# EasyEDA Pro project ALU.eprj

# Schematic Schematic2
Board Name: Board2; Create Date: 2025-08-15; Page Name: P1; Project Name: ALU; Schematic Name: Schematic2; Update Date: 2025-08-15; Company: EasyEDA.com; Page Size: A4; Version: V1.0
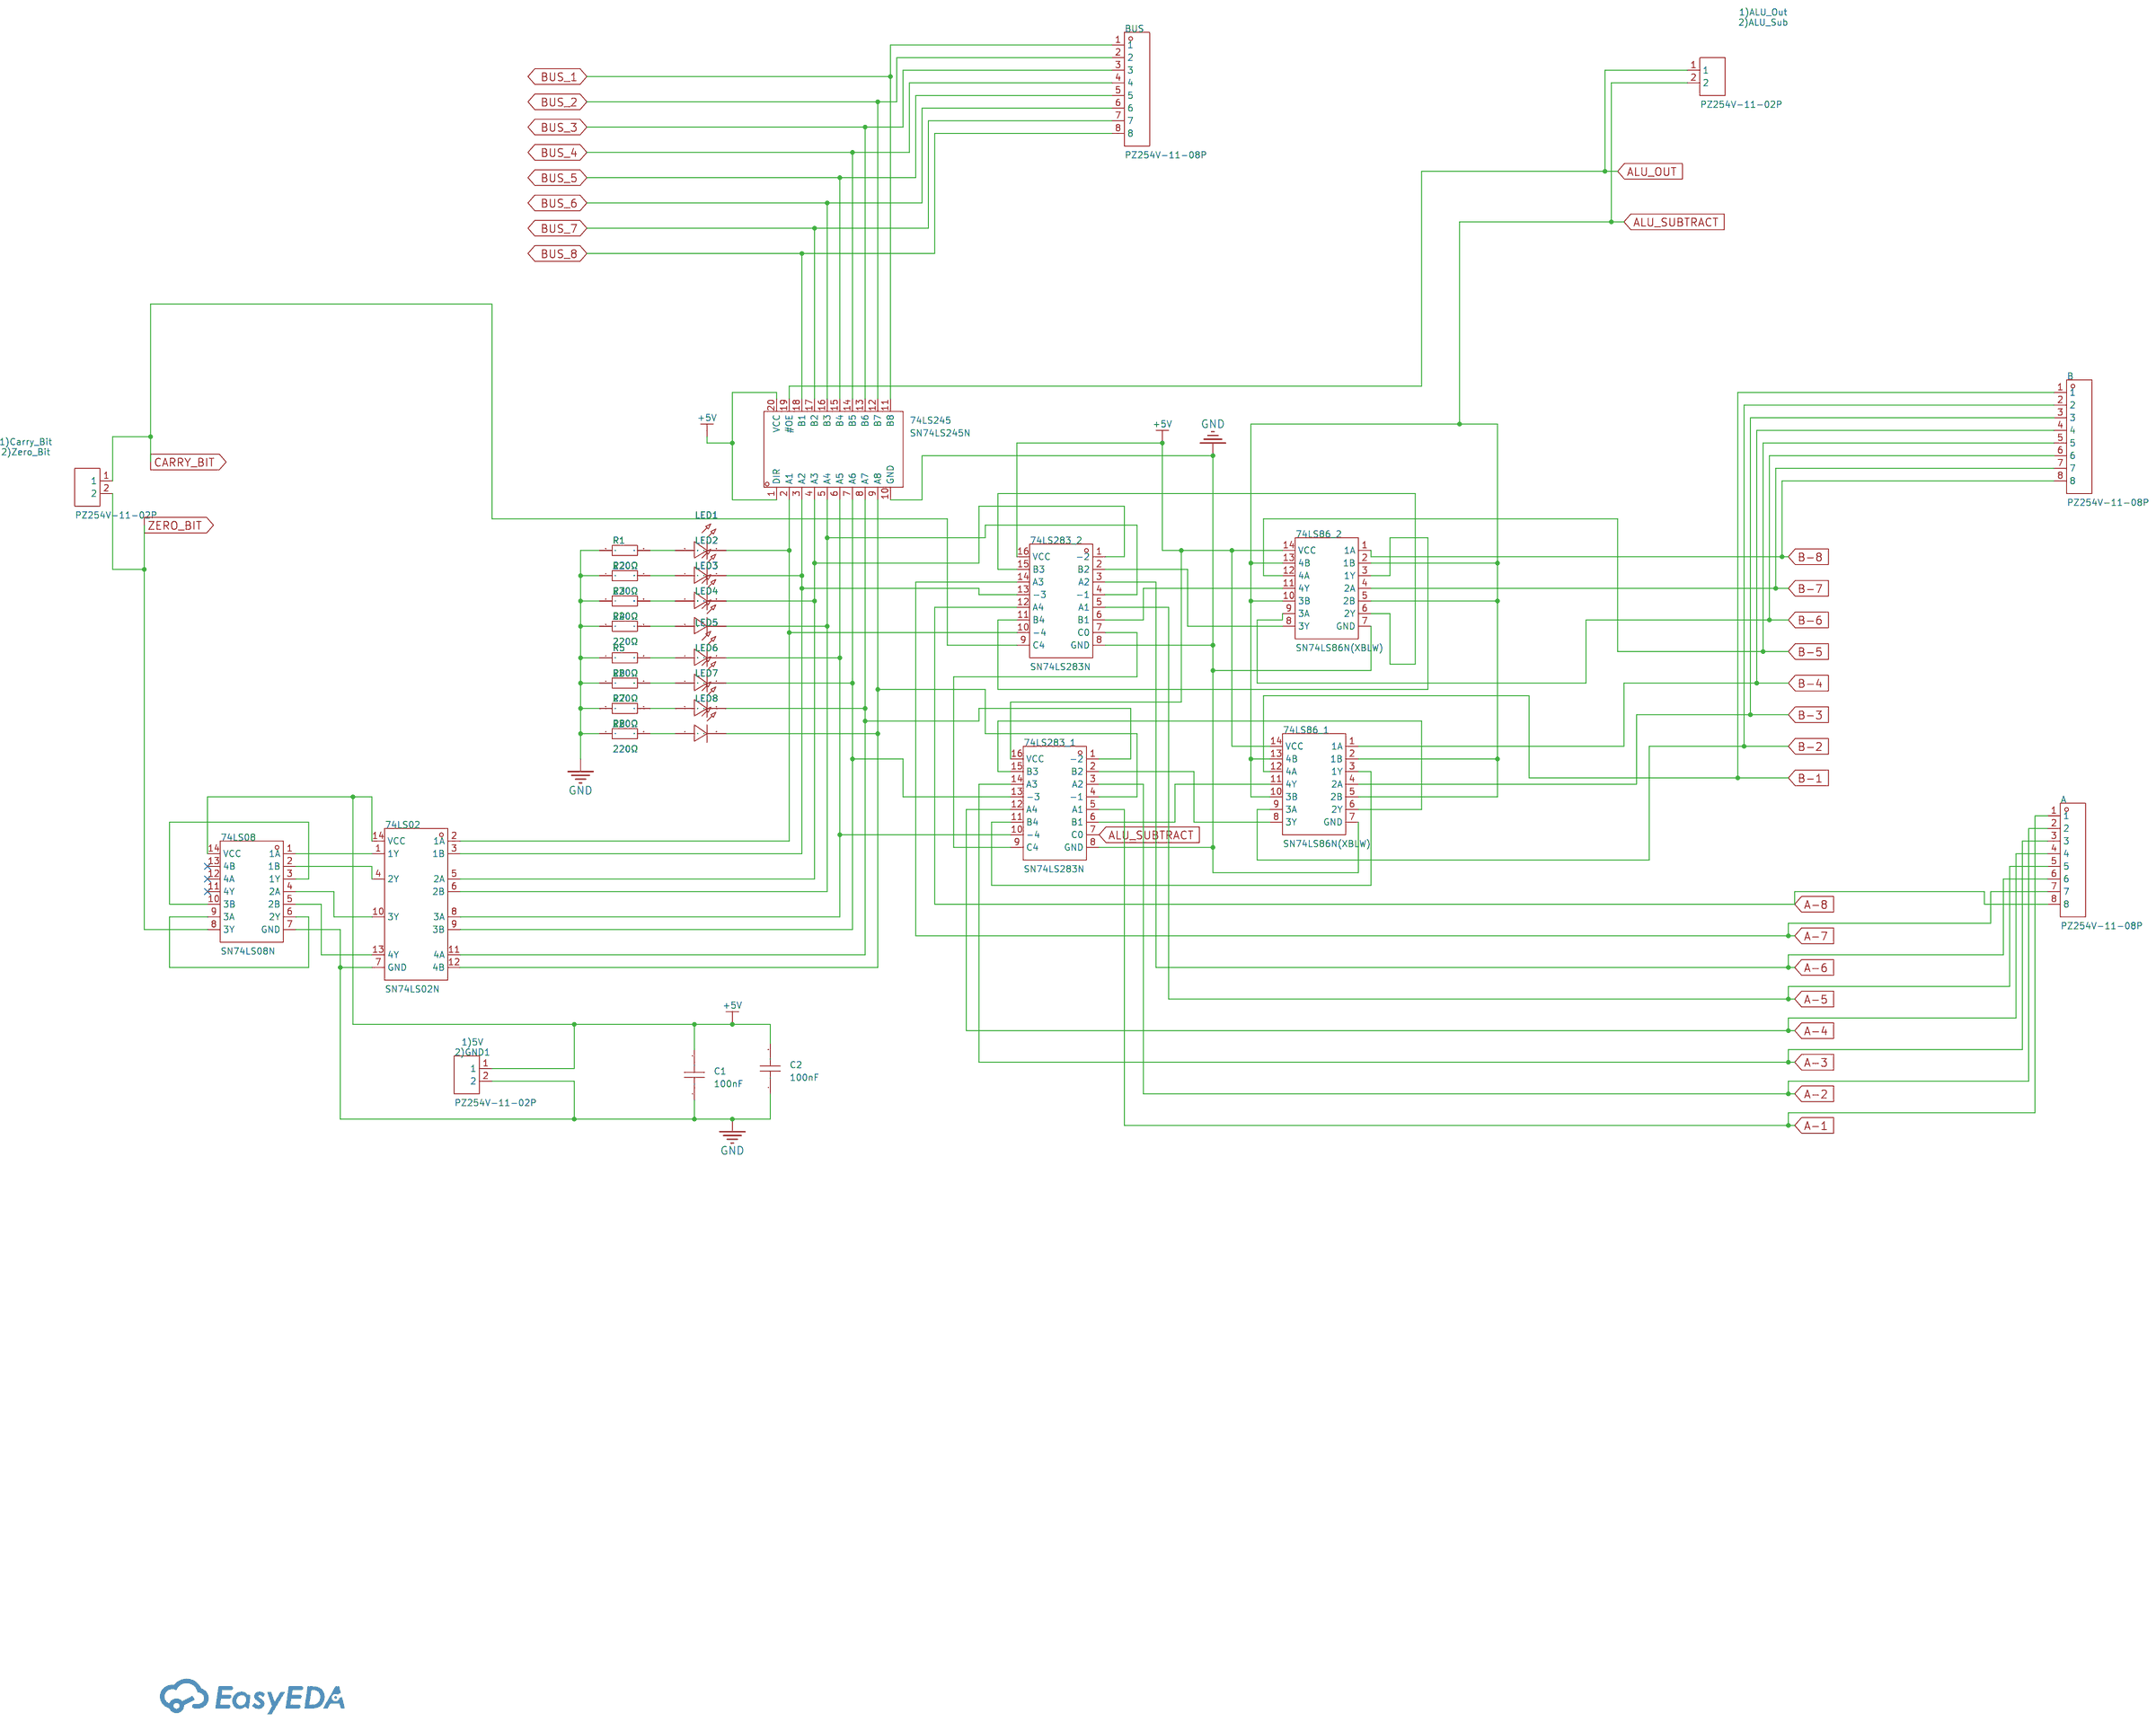
[diagram p0: schematic sheet]

## Parts
1)5V
2)GND1  PZ254V-11-02P  [HDR-TH_2P-P2.54-V-M]
1)ALU_Out
2)ALU_Sub  PZ254V-11-02P  [HDR-TH_2P-P2.54-V-M]
1)Carry_Bit
2)Zero_Bit  PZ254V-11-02P  [HDR-TH_2P-P2.54-V-M]
74LS02  SN74LS02N  [PDIP-14_L19.3-W6.4-P2.54-LS7.6-BL]
74LS08  SN74LS08N  [PDIP-14_L19.3-W6.4-P2.54-LS7.9-BL-1]
74LS86_1  SN74LS86N(XBLW)  [DIP-14_L19.0-W6.4-P2.54-LS7.6-BL]
74LS86_2  SN74LS86N(XBLW)  [DIP-14_L19.0-W6.4-P2.54-LS7.6-BL]
74LS245  SN74LS245N  [DIP-20_L25.5-W10.0-P2.54-LS7.6-BL]
74LS283_1  SN74LS283N  [PDIP-16_L19.3-W6.4-P2.54-LS7.94-BL]
74LS283_2  SN74LS283N  [PDIP-16_L19.3-W6.4-P2.54-LS7.94-BL]
A  PZ254V-11-08P  [HDR-TH_8P-P2.54-V-M]
B  PZ254V-11-08P  [HDR-TH_8P-P2.54-V-M]
BUS  PZ254V-11-08P  [HDR-TH_8P-P2.54-V-M]
C1  100nF  [CAP-TH_L8.5-W5.0-P5.00-D1.2]
C2  100nF  [CAP-TH_L8.5-W5.0-P5.00-D1.2]
LED1  -  [LED-TH_BD5.8-P2.54-FD]
LED2  -  [LED-TH_BD5.8-P2.54-FD]
LED3  -  [LED-TH_BD5.8-P2.54-FD]
LED4  -  [LED-TH_BD5.8-P2.54-FD]
LED5  -  [LED-TH_BD5.8-P2.54-FD]
LED6  -  [LED-TH_BD5.8-P2.54-FD]
LED7  -  [LED-TH_BD5.8-P2.54-FD]
LED8  -  [LED-TH_BD5.8-P2.54-FD]
R1  220Ω  [R_AXIAL-0.4]
R2  220Ω  [R_AXIAL-0.4]
R3  220Ω  [R_AXIAL-0.4]
R4  220Ω  [R_AXIAL-0.4]
R5  220Ω  [R_AXIAL-0.4]
R6  220Ω  [R_AXIAL-0.4]
R7  220Ω  [R_AXIAL-0.4]
R8  220Ω  [R_AXIAL-0.4]

## Library data of the parts
1)5V
2)GND1 1)ALU_Out
2)ALU_Sub 1)Carry_Bit
2)Zero_Bit = PZ254V-11-02P: Pin Structure:1x2P Pitch:2.54mm Row Spacing:- Circluar Pins/Square Pins:Policy Mounting Type:Straight Number of Rows:Single Row Number of Pins:2P Current Rating:- Voltage Rating (Max):- Length of Mating Pin:6mm Insulation Height:2.5mm Length of End Connec; LCSC Part Name: 1x2P 间距:2.54mm 方针 直插; Supplier Part: C492401; Manufacturer: XFCN(兴飞); Supplier Footprint: 插件,P=2.54mm; JLCPCB Part Class: Extended Part; Datasheet: https://atta.szlcsc.com/upload/public/pdf/source/20200309/C492401_A812433581A9B211A7FFA413ADDFF0E5.pdf; Supplier: LCSC; Pin Structure: 1x2P; Pitch: 2.54mm; Circluar Pins/Square Pins: Policy; Mounting Type: Straight; Number of Rows: Single Row; Number of Pins: 2P; Length of Mating Pin: 6mm; Insulation Height: 2.5mm; Length of End Connection Pin: 3mm; Contact Material: Brass; Operating Temperature: -40℃~+105℃; Color: Black
74LS02 = SN74LS02N: Logic Gate Type:NORGate Number of Channels:4 Supply Voltage:4.75V~5.25V Supply Voltage:4.75V~5.25V Sink Current:16mA Source Current:400uA High Level Range (VIH):2V High Level Range (VIH):2V Low Level Range (VIL):800mV Low Level Range (VIL):800mV Series:74; Supplier Part: C273654; Manufacturer: TI(德州仪器); Supplier Footprint: PDIP-14; JLCPCB Part Class: Extended Part; Datasheet: https://www.ti.com/cn/lit/gpn/sn74ls02; Supplier: LCSC; Logic Gate Type: NORGate; Number of Channels: 4; Supply Voltage: 4.75V~5.25V; Sink Current: 16mA; Source Current: 400uA; High Level Range (VIH): 2V; Low Level Range (VIL): 800mV; Series: 74LSSeries; Propagation Delay Time: 15ns@5V,15pF; Operating Temperature: 0℃~+70℃
74LS08 = SN74LS08N: Logic Type:AND Gate Number of Channels:4 Voltage - Supply:4.75V~5.25V Voltage - Supply:4.75V~5.25V Current - Output Low(IOL):8mA Current - Output High(IOH):400uA Input Logic Level - High:2V Input Logic Level - High:2V Input Logic Level - Low:800mV Input L; Supplier Part: C2869595; Manufacturer: TI(德州仪器); Supplier Footprint: PDIP-14; JLCPCB Part Class: Extended Part; Datasheet: https://www.ti.com/cn/lit/gpn/sn54s08; Supplier: LCSC; Logic Type: AND Gate; Number of Channels: 4; Voltage - Supply: 4.75V~5.25V; Current - Output Low(IOL): 8mA; Current - Output High(IOH): 400uA; Input Logic Level - High: 2V; Input Logic Level - Low: 800mV; Series: 74LSSeries; Operating Temperature: 0℃~+70℃
74LS86_1 74LS86_2 = SN74LS86N(XBLW): Logic Type:XOR Gate Number of Channels:4 Voltage - Supply:2V~6V Voltage - Supply:2V~6V Quiescent Current:2uA Current - Output Low(IOL):5.2mA Current - Output High(IOH):5.2mA Input Logic Level - High:1.2V~3.2V Input Logic Level - High:1.2V~3.2V Input Logic; Supplier Part: C42415784; Manufacturer: XBLW(芯伯乐); Supplier Footprint: DIP-14; Datasheet: https://atta.szlcsc.com/upload/public/pdf/source/20241217/4BD867E8FF5FB27D45A6321784BC3EB1.pdf; Supplier: LCSC; Logic Type: XOR Gate; Number of Channels: 4; Voltage - Supply: 2V~6V; Quiescent Current: 2uA; Current - Output Low(IOL): 5.2mA; Current - Output High(IOH): 5.2mA; Input Logic Level - High: 1.2V~3.2V; Input Logic Level - Low: 800mV~2.8V; Output Logic Level - High: 2V~5.81V
74LS245 = SN74LS245N: output type:Tri-State Voltage - Supply:4.75V~5.25V Voltage - Supply:4.75V~5.25V Number of Elements:1 Number of Bits per Element:8 Current - Output Low(IOL):24mA Current - Output High(IOH):15mA Logic Family:74LS Operating Temperature:0℃~+70℃ Operating Temp; Supplier Part: C352966; Manufacturer: TI(德州仪器); Supplier Footprint: DIP-20; JLCPCB Part Class: Extended Part; Datasheet: https://www.ti.com/cn/lit/gpn/sn74ls245; Supplier: LCSC; output type: Tri-State; Voltage - Supply: 4.75V~5.25V; Number of Elements: 1; Number of Bits per Element: 8; Current - Output Low(IOL): 24mA; Current - Output High(IOH): 15mA; Logic Family: 74LS; Operating Temperature: 0℃~+70℃
74LS283_1 74LS283_2 = SN74LS283N: LCSC Part Name: 二进制全加器; Supplier Part: C1523494; Manufacturer: TI(德州仪器); Supplier Footprint: PDIP-16; JLCPCB Part Class: Extended Part; Datasheet: https://www.ti.com/cn/lit/gpn/sn74ls283; Supplier: LCSC
A B BUS = PZ254V-11-08P: Pin Structure:1x8P Pitch:2.54mm Row Spacing:- Circluar Pins/Square Pins:Square Pins Mounting Type:Straight Number of Rows:Plugin Number of Pins:8P Current Rating (Max):- Voltage Rating (Max):- Length of Mating Pin:6mm Insulation Height:2.5mm Length of End; LCSC Part Name: 间距:2.54mm 1x8P 直插 方针; Supplier Part: C492407; Manufacturer: XFCN(兴飞); Supplier Footprint: 插件,P=2.54mm; JLCPCB Part Class: Extended Part; Datasheet: https://atta.szlcsc.com/upload/public/pdf/source/20200309/C492407_83A6FB26A2233368EDB9516968EC6149.pdf; Supplier: LCSC; Pin Structure: 1x8P; Pitch: 2.54mm; Circluar Pins/Square Pins: Square Pins; Mounting Type: Straight; Number of Rows: Plugin; Number of Pins: 8P; Length of Mating Pin: 6mm; Insulation Height: 2.5mm; Length of End Connection Pin: 3mm; Operating Temperature Range: -40℃~+105℃; Color: Black
C1 C2 = CT4-0805B104K500F3: Capacitance:100nF Tolerance:±10% Tolerance:±10% Voltage Rated: Temperature Coefficient:; LCSC Part Name: 100nF ±10% 50V C3型（直脚）; Supplier Part: C84772; Manufacturer: FH(风华); Supplier Footprint: 插件,P=5.08mm; JLCPCB Part Class: Extended Part; Datasheet: https://atta.szlcsc.com/upload/public/pdf/source/20190402/C385200_059806A6312B28FF1421A2413EB641E1.pdf; Supplier: LCSC; Tolerance: ±10%
LED1-LED8 = LED_TH-R_5mm: Supplier Footprint: Through
R1-R8 = Res_AXIAL-1/4W: Supplier Footprint: Through

## Nets
+5V: 1)5V
2)GND1.1 74LS02.14(VCC) 74LS08.14(VCC) 74LS86_1.14(VCC) 74LS86_2.14(VCC) 74LS245.1(DIR) 74LS245.20(VCC) 74LS283_1.16(VCC) 74LS283_2.16(VCC) C1.2 C2.2
GND: 1)5V
2)GND1.2 74LS02.7(GND) 74LS08.7(GND) 74LS86_1.7(GND) 74LS86_2.7(GND) 74LS245.10(GND) 74LS283_1.8(GND) 74LS283_2.8(GND) C1.1 C2.1 R1.1 R2.1 R3.1 R4.1 R5.1 R6.1 R7.1 R8.1
A-1: 74LS283_1.5(A1) A.1
A-2: 74LS283_1.3(A2) A.2
A-3: 74LS283_1.14(A3) A.3
A-4: 74LS283_1.12(A4) A.4
A-5: 74LS283_2.5(A1) A.5
A-6: 74LS283_2.3(A2) A.6
A-7: 74LS283_2.14(A3) A.7
A-8: 74LS283_2.12(A4) A.8
ALU_OUT: 1)ALU_Out
2)ALU_Sub.1 74LS245.19(#OE)
ALU_SUBTRACT: 1)ALU_Out
2)ALU_Sub.2 74LS86_1.2(1B) 74LS86_1.5(2B) 74LS86_1.10(3B) 74LS86_1.13(4B) 74LS86_2.2(1B) 74LS86_2.5(2B) 74LS86_2.10(3B) 74LS86_2.13(4B) 74LS283_1.7(C0)
B-1: 74LS86_1.12(4A) B.1
B-2: 74LS86_1.9(3A) B.2
B-3: 74LS86_1.4(2A) B.3
B-4: 74LS86_1.1(1A) B.4
B-5: 74LS86_2.12(4A) B.5
B-6: 74LS86_2.9(3A) B.6
B-7: 74LS86_2.4(2A) B.7
B-8: 74LS86_2.1(1A) B.8
BUS_1: 74LS245.11(B8) BUS.1
BUS_2: 74LS245.12(B7) BUS.2
BUS_3: 74LS245.13(B6) BUS.3
BUS_4: 74LS245.14(B5) BUS.4
BUS_5: 74LS245.15(B4) BUS.5
BUS_6: 74LS245.16(B3) BUS.6
BUS_7: 74LS245.17(B2) BUS.7
BUS_8: 74LS245.18(B1) BUS.8
CARRY_BIT: 1)Carry_Bit
2)Zero_Bit.1 74LS283_2.9(C4)
ZERO_BIT: 1)Carry_Bit
2)Zero_Bit.2 74LS08.8(3Y)
$1N3474: LED1.1(C) R1.2
$1N3475: 74LS02.2(1A) 74LS245.2(A1) 74LS283_2.10(-4) LED1.2(A)
$1N3476: LED2.1(C) R2.2
$1N3477: LED3.1(C) R3.2
$1N3478: 74LS02.5(2A) 74LS245.4(A3) 74LS283_2.1(-2) LED3.2(A)
$1N3479: LED4.1(C) R4.2
$1N3480: LED5.1(C) R5.2
$1N3481: LED6.1(C) R6.2
$1N3482: LED7.1(C) R7.2
$1N3483: 74LS02.11(4A) 74LS245.8(A7) 74LS283_1.1(-2) LED7.2(A)
$1N3484: LED8.1(C) R8.2
$1N3486: 74LS02.1(1Y) 74LS08.1(1A)
$1N3487: 74LS08.3(1Y) 74LS08.10(3B)
$1N3488: 74LS02.10(3Y) 74LS08.4(2A)
$1N3489: 74LS02.4(2Y) 74LS08.2(1B)
$1N3491: 74LS02.8(3A) 74LS245.6(A5) 74LS283_1.10(-4) LED5.2(A)
$1N3492: 74LS02.6(2B) 74LS245.5(A4) 74LS283_2.4(-1) LED4.2(A)
$1N3493: 74LS02.3(1B) 74LS245.3(A2) 74LS283_2.13(-3) LED2.2(A)
$1N3494: 74LS283_1.9(C4) 74LS283_2.7(C0)
$1N3495: 74LS02.12(4B) 74LS245.9(A8) 74LS283_1.4(-1) LED8.2(A)
$1N3496: 74LS02.9(3B) 74LS245.7(A6) 74LS283_1.13(-3) LED6.2(A)
$1N3497: 74LS86_2.3(1Y) 74LS283_2.11(B4)
$1N3498: 74LS86_2.8(3Y) 74LS283_2.2(B2)
$1N3499: 74LS86_2.11(4Y) 74LS283_2.6(B1)
$1N3502: 74LS86_1.3(1Y) 74LS283_1.11(B4)
$1N3503: 74LS86_1.6(2Y) 74LS283_1.15(B3)
$1N3504: 74LS86_1.11(4Y) 74LS283_1.6(B1)
$1N3511: 74LS86_1.8(3Y) 74LS283_1.2(B2)
$1N3518: 74LS86_2.6(2Y) 74LS283_2.15(B3)
$1N3523: 74LS08.6(2Y) 74LS08.9(3A)
$1N3524: 74LS02.13(4Y) 74LS08.5(2B)

Not connected (* = marked no-connect by the designer): 74LS08 11(4Y)* 12(4A)* 13(4B)*

# Board PCB2
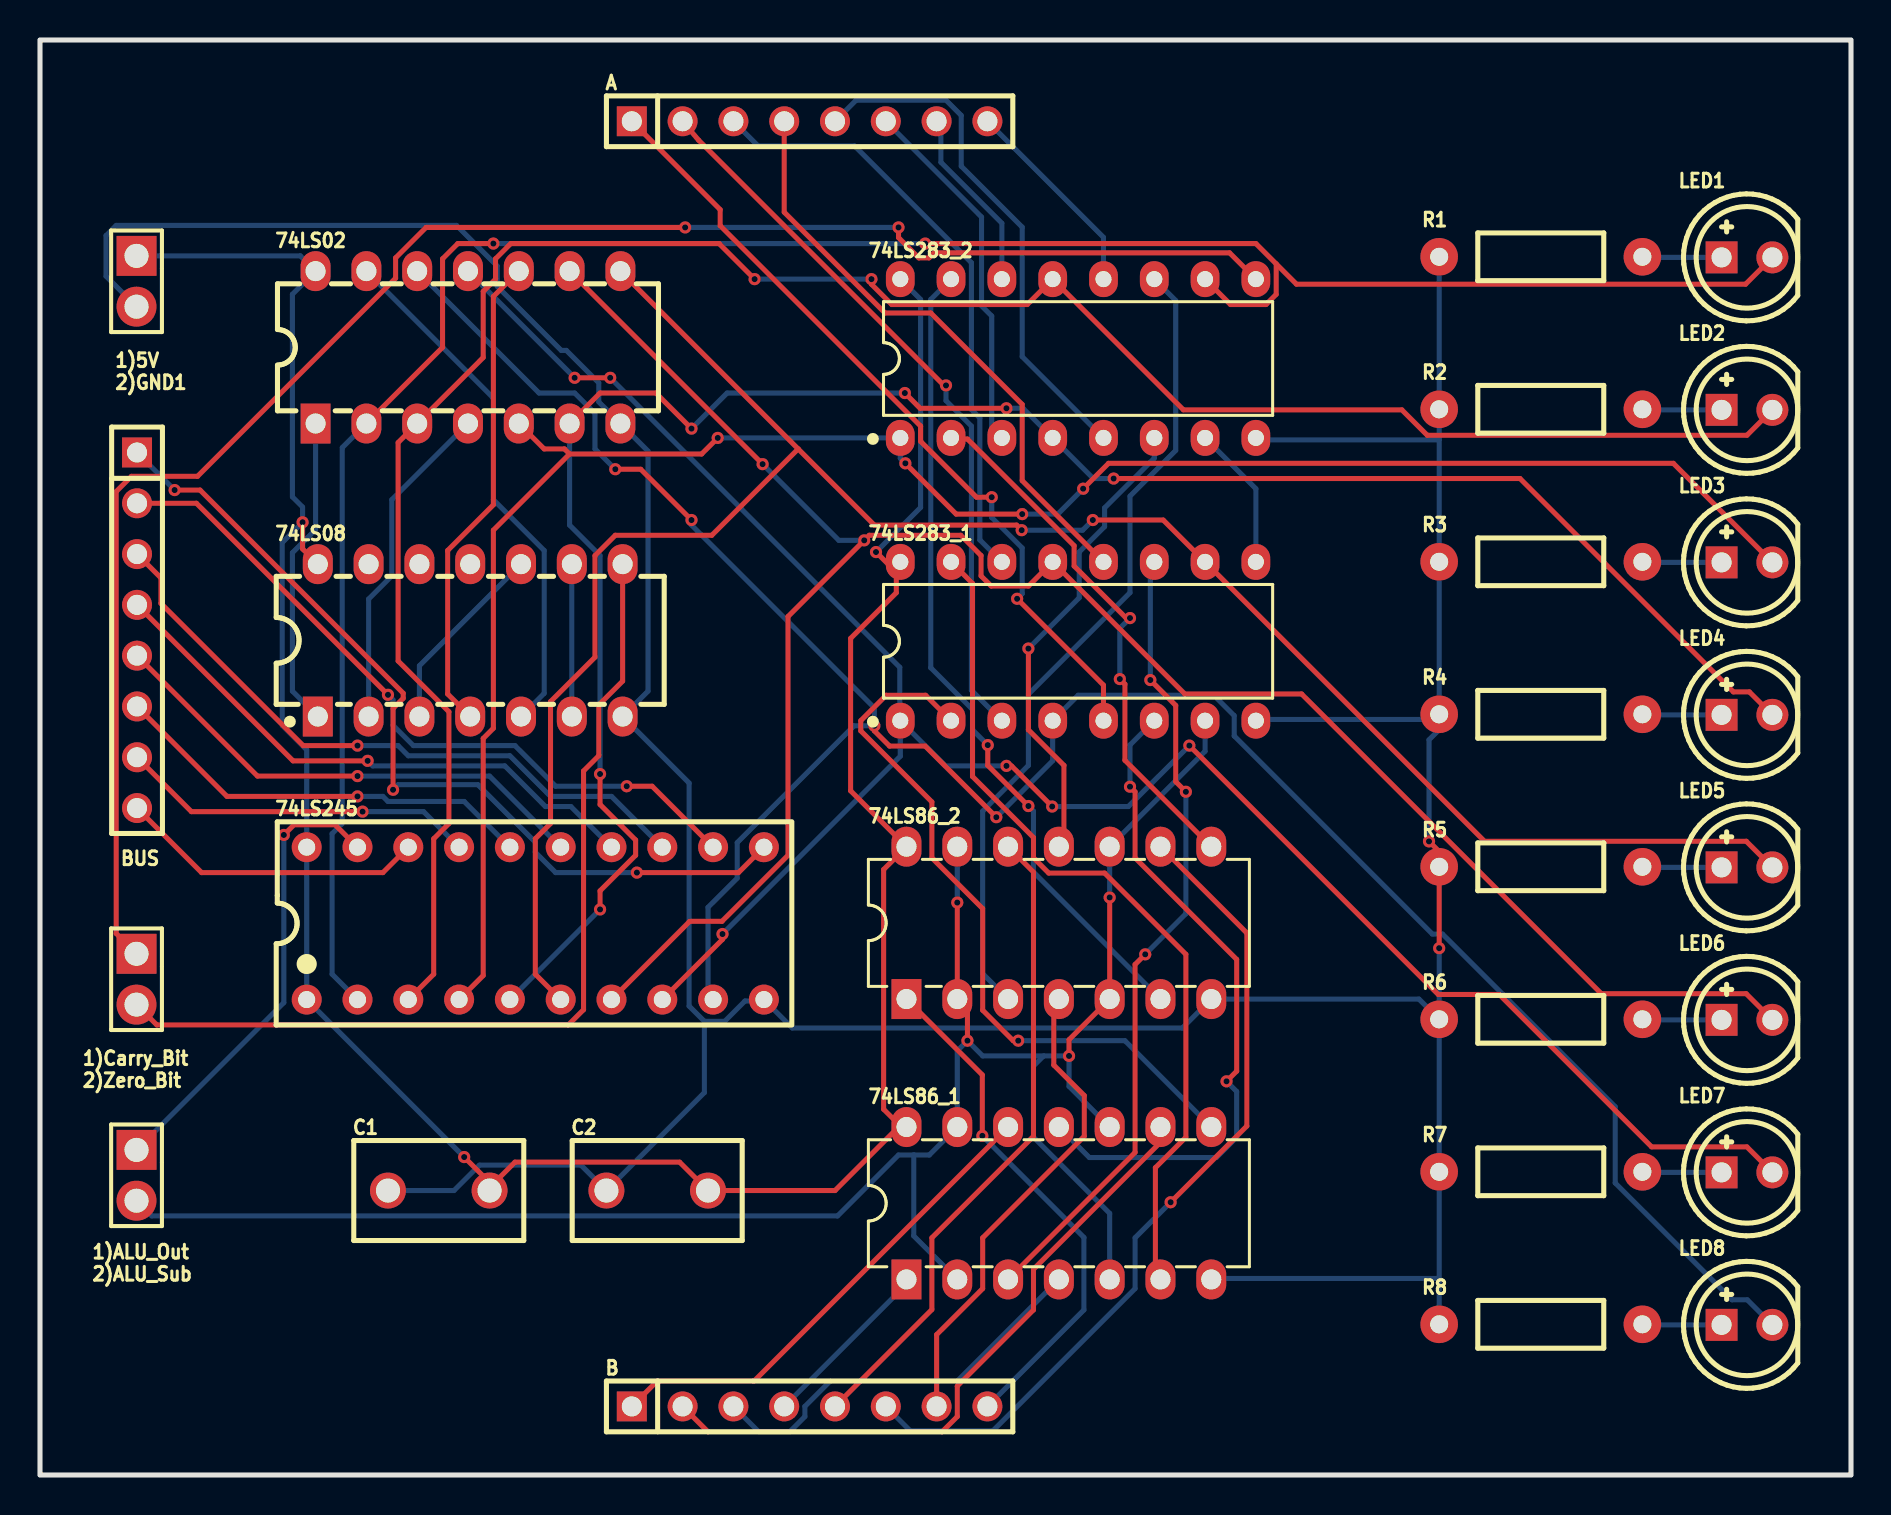
[diagram p1: board, top side]
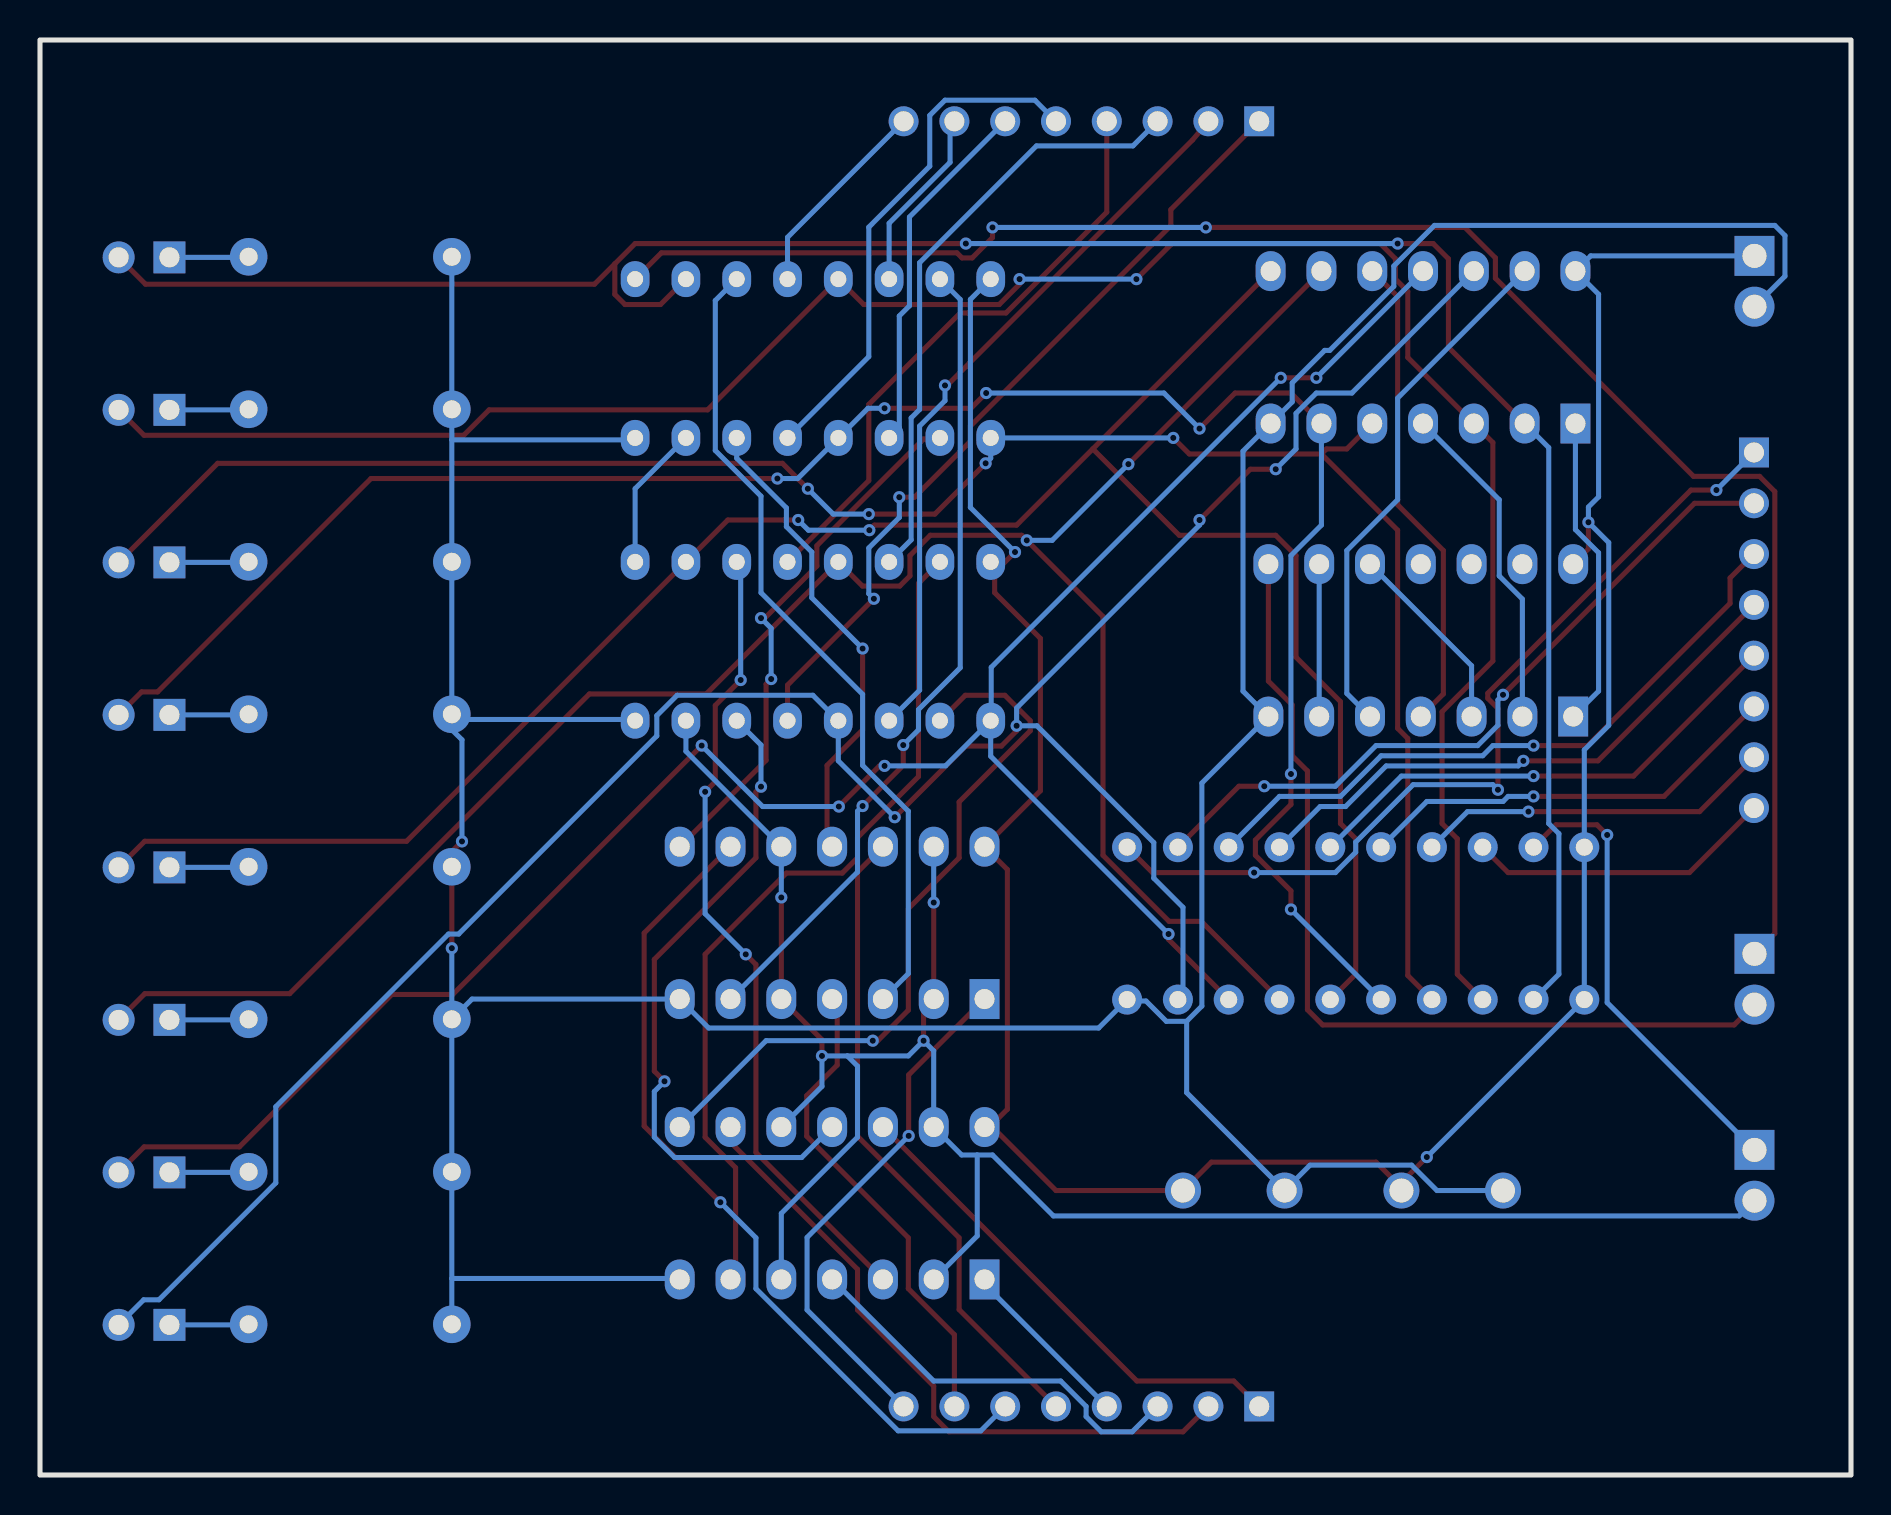
[diagram p2: board, bottom side, seen from below]

Outline 90.55 x 71.75 mm; copper layers: Top Layer, Bottom Layer. Coordinates in mm from the lower left corner of the outline.
Outline path: rectangle 0,71.75 90.55,0
Stack: Top Layer 0.035mm / Dielectric1 1.51mm FR4 er 4.5 / Bottom Layer 0.035mm

## Design rules (mm)
template: JLCPCB Capability(Two Layers Board)
spacing copperThickness1oz (default): track to track 0.102, other pairs 0.152 to 0.3
spacing copperThickness2oz: track to track 0.203, other pairs 0.152 to 0.3
track width copperThickness1oz (default): min 0.127, default 0.254, max 2.54
track width copperThickness2oz: min 0.203, default 0.254, max 2.54
differential pair differentialPair (default): width min 0.127, default 0.254, max 2.54; gap min 0.152, default 0.152
via viaSize (default): diameter min 0.5, default 0.61, max 10; hole min 0.3, default 0.305, max 6.3

## Placement (name value [footprint] x y rotation side)
1)5V
2)GND1  PZ254V-11-02P  [HDR-TH_2P-P2.54-V-M]  4.83 59.69 270 top
1)ALU_Out
2)ALU_Sub  PZ254V-11-02P  [HDR-TH_2P-P2.54-V-M]  4.83 14.99 270 top
1)Carry_Bit
2)Zero_Bit  PZ254V-11-02P  [HDR-TH_2P-P2.54-V-M]  4.83 24.79 270 top
74LS02  SN74LS02N  [PDIP-14_L19.3-W6.4-P2.54-LS7.6-BL]  21.4 56.39 0 top
74LS08  SN74LS08N  [PDIP-14_L19.3-W6.4-P2.54-LS7.9-BL-1]  21.51 41.74 0 top
74LS86_1  SN74LS86N(XBLW)  [DIP-14_L19.0-W6.4-P2.54-LS7.6-BL]  50.94 13.59 0 top
74LS86_2  SN74LS86N(XBLW)  [DIP-14_L19.0-W6.4-P2.54-LS7.6-BL]  50.94 27.61 0 top
74LS245  SN74LS245N  [DIP-20_L25.5-W10.0-P2.54-LS7.6-BL]  24.77 27.58 0 top
74LS283_1  SN74LS283N  [PDIP-16_L19.3-W6.4-P2.54-LS7.94-BL]  51.9 41.69 0 top
74LS283_2  SN74LS283N  [PDIP-16_L19.3-W6.4-P2.54-LS7.94-BL]  51.9 55.83 0 top
A  PZ254V-11-08P  [HDR-TH_8P-P2.54-V-M]  38.48 67.69 0 top
B  PZ254V-11-08P  [HDR-TH_8P-P2.54-V-M]  38.48 3.43 0 top
BUS  PZ254V-11-08P  [HDR-TH_8P-P2.54-V-M]  4.85 42.24 270 top
C1  100nF  [CAP-TH_L8.5-W5.0-P5.00-D1.2]  19.94 14.22 0 top
C2  100nF  [CAP-TH_L8.5-W5.0-P5.00-D1.2]  30.86 14.22 0 top
LED1  -  [LED-TH_BD5.8-P2.54-FD]  85.35 60.89 0 top
LED2  -  [LED-TH_BD5.8-P2.54-FD]  85.35 53.26 0 top
LED3  -  [LED-TH_BD5.8-P2.54-FD]  85.35 45.63 0 top
LED4  -  [LED-TH_BD5.8-P2.54-FD]  85.35 38.01 0 top
LED5  -  [LED-TH_BD5.8-P2.54-FD]  85.35 30.38 0 top
LED6  -  [LED-TH_BD5.8-P2.54-FD]  85.35 22.76 0 top
LED7  -  [LED-TH_BD5.8-P2.54-FD]  85.35 15.13 0 top
LED8  -  [LED-TH_BD5.8-P2.54-FD]  85.35 7.51 0 top
R1  220Ω  [R_AXIAL-0.4]  75.04 60.91 0 top
R2  220Ω  [R_AXIAL-0.4]  75.04 53.29 0 top
R3  220Ω  [R_AXIAL-0.4]  75.04 45.66 0 top
R4  220Ω  [R_AXIAL-0.4]  75.04 38.04 0 top
R5  220Ω  [R_AXIAL-0.4]  75.04 30.41 0 top
R6  220Ω  [R_AXIAL-0.4]  75.04 22.79 0 top
R7  220Ω  [R_AXIAL-0.4]  75.04 15.16 0 top
R8  220Ω  [R_AXIAL-0.4]  75.04 7.54 0 top

## Footprints (pads in the part's own frame, mm; a bottom-side part is the same pattern mirrored in y, then rotated)
CAP-TH_L8.5-W5.0-P5.00-D1.2
  round 1.8 hole 1.2: 1(-2.54,0) 2(2.54,0)
DIP-14_L19.0-W6.4-P2.54-LS7.6-BL
  rect 1.5x2 hole 1: 1(-7.62,-3.81)
  oval 1.5x2 hole 1: 2(-5.08,-3.81) 3(-2.54,-3.81) 4(0,-3.81) 5(2.54,-3.81) 6(5.08,-3.81) 7(7.62,-3.81) 8(7.62,3.81) 9(5.08,3.81) 10(2.54,3.81) 11(0,3.81) 12(-2.54,3.81) 13(-5.08,3.81) 14(-7.62,3.81)
DIP-20_L25.5-W10.0-P2.54-LS7.6-BL
  round 1.5 hole 0.85: 1(-11.43,-3.81) 2(-8.89,-3.81) 3(-6.35,-3.81) 4(-3.81,-3.81) 5(-1.27,-3.81) 6(1.27,-3.81) 7(3.81,-3.81) 8(6.35,-3.81) 9(8.89,-3.81) 10(11.43,-3.81) 11(11.43,3.81) 12(8.89,3.81) 13(6.35,3.81) 14(3.81,3.81) 15(1.27,3.81) 16(-1.27,3.81) 17(-3.81,3.81) 18(-6.35,3.81) 19(-8.89,3.81) 20(-11.43,3.81)
HDR-TH_2P-P2.54-V-M
  rect 2x2 hole 1.2: 1(-1.27,0)
  round 2 hole 1.2: 2(1.27,0)
HDR-TH_8P-P2.54-V-M
  rect 1.5x1.5 hole 1: 1(-8.89,0)
  round 1.5 hole 1: 2(-6.35,0) 3(-3.81,0) 4(-1.27,0) 5(1.27,0) 6(3.81,0) 7(6.35,0) 8(8.89,0)
LED-TH_BD5.8-P2.54-FD
  rect 1.6x1.6 hole 1: 1(-1.27,0)
  round 1.6 hole 1: 2(1.27,0)
PDIP-14_L19.3-W6.4-P2.54-LS7.6-BL
  rect 1.5x2 hole 1: 1(-7.62,-3.81)
  oval 1.5x2 hole 1: 2(-5.08,-3.81) 3(-2.54,-3.81) 4(0,-3.81) 5(2.54,-3.81) 6(5.08,-3.81) 7(7.62,-3.81) 8(7.62,3.81) 9(5.08,3.81) 10(2.54,3.81) 11(0,3.81) 12(-2.54,3.81) 13(-5.08,3.81) 14(-7.62,3.81)
PDIP-14_L19.3-W6.4-P2.54-LS7.9-BL-1
  rect 1.5x2 hole 1: 1(-7.62,-3.809)
  oval 1.5x2 hole 1: 2(-5.08,-3.81) 3(-2.54,-3.81) 4(0,-3.81) 5(2.54,-3.81) 6(5.08,-3.81) 7(7.62,-3.81) 8(7.62,3.81) 9(5.08,3.81) 10(2.54,3.81) 11(0,3.81) 12(-2.54,3.81) 13(-5.08,3.81) 14(-7.62,3.81)
PDIP-16_L19.3-W6.4-P2.54-LS7.94-BL
  oval 1.44x1.8 hole 0.8: 1(-8.89,-3.97) 2(-6.35,-3.97) 3(-3.81,-3.97) 4(-1.27,-3.97) 5(1.27,-3.97) 6(3.81,-3.97) 7(6.35,-3.97) 8(8.89,-3.97) 9(8.89,3.97) 10(6.35,3.97) 11(3.81,3.97) 12(1.27,3.97) 13(-1.27,3.97) 14(-3.81,3.97) 15(-6.35,3.97) 16(-8.89,3.97)
R_AXIAL-0.4
  round 1.879 hole 0.899: 1(-5.08,0) 2(5.08,0)

## Nets
As in the schematic.

Pads without a net: 74LS08 11 12 13

## Via types
v1: diameter 0.61, hole 0.305, Top Layer to Bottom Layer, 66 vias

## Routing (per net, layer and track width the routed paths; a pad name or vN(x,y) marks a point on that pad's centre or on a via; arc(x,y) is an arc through that point)
+5V: length 134.1
  Top Layer w0.254: v1(13.13,47.64) 13.13,46.31 74LS08.14 ; 43.2,17.27 74LS86_1.14 ; 43.2,17.27 42.18,18.29 42.18,30.28 74LS86_2.14 40.53,34.21 40.53,41.83 42.82,44.12 42.82,45.39 ; 43.2,17.27 42.8,17.27 39.75,14.22 C2.2 31.98,15.64 23.75,15.64 22.48,14.37 ; 42.82,45.39 42.82,45.46 74LS283_1.16 ; 42.82,45.39 42.56,45.39 v1(41.8,46.15) ; v1(21.21,15.9) 22.48,14.63 22.48,14.37 ; 22.48,14.37 C1.2
  Bottom Layer w0.254: v1(41.8,46.15) 44.03,48.38 44.03,58.78 74LS283_2.16 ; 1)5V
2)GND1.1 13.02,60.96 13.78,60.2 12.62,59.04 12.62,48.91 13.13,48.4 v1(13.13,47.64) 12.11,46.62 12.11,37.48 13.34,36.26 74LS245.20 74LS245.1 v1(21.21,15.9)
GND: length 213
  Top Layer w0.254: v1(69.45,31.68) 69.96,31.17 R5.1 v1(69.96,26.34)
  Bottom Layer w0.254: 36.27,23.7 35.25,23.7 34.23,22.69 33.22,22.69 ; 36.27,23.7 74LS245.10 ; 36.27,23.7 37.62,22.35 57.12,22.35 74LS86_2.7 68.95,23.8 R6.1 ; 69.96,51.76 R2.1 R1.1 ; 69.96,51.76 60.89,51.76 74LS283_2.8 ; 69.96,51.76 R3.1 R4.1 69.96,37.78 ; 69.96,37.78 69.96,37.27 69.45,36.76 v1(69.45,31.68) ; 69.96,37.78 60.86,37.78 74LS283_1.8 ; R6.1 R7.1 69.96,9.83 ; R6.1 v1(69.96,26.34) ; 33.22,22.69 33.22,19.12 28.32,14.22 27.05,15.49 21.97,15.49 20.7,14.22 C1.1 ; 33.22,22.69 32.46,23.45 32.46,34.6 74LS08.7 30.4,39.2 30.4,51.2 74LS02.7 27.94,53.66 27.94,54.61 26.32,56.23 26.06,56.23 22.86,59.44 22.86,60.45 20.83,62.48 3.81,62.48 3.3,61.98 3.3,59.94 1)5V
2)GND1.2 ; 74LS86_1.7 58.61,9.83 69.96,9.83 ; 69.96,9.83 R8.1
A-1: length 40.4
  Top Layer w0.254: 74LS283_1.5 53.17,39.5 v1(48.86,43.81) ; A.1 34.01,63.27 34.01,62.47 44.03,52.45 44.03,51.69 46.82,48.89 v1(47.59,48.89)
  Bottom Layer w0.254: v1(48.86,43.81) 49.11,44.07 49.11,46.35 47.59,47.88 v1(47.59,48.89)
A-2: length 36.6
  Top Layer w0.254: A.2 32.93,66.75 45.2,54.48 v1(45.3,54.48)
  Bottom Layer w0.254: 74LS283_1.3 46.57,39.24 46.57,52.45 45.3,53.72 v1(45.3,54.48)
A-3: length 30.4
  Bottom Layer w0.254: A.3 35.9,66.46 40.73,66.46 46.57,60.62 46.57,53.28 46.99,52.86 46.99,46.76 74LS283_1.14
A-4: length 30
  Top Layer w0.254: 37.21,67.69 37.21,63.15 42.25,58.1 44.54,58.1 49.11,53.53 49.11,49.72 74LS283_1.12
A-5: length 26.1
  Bottom Layer w0.254: 74LS283_2.5 49.11,55.92 49.11,62.4 46.06,65.44 46.06,67.98 45.3,68.75 40.81,68.75 A.5
A-6: length 18.2
  Bottom Layer w0.254: 74LS283_2.3 47.59,52.37 47.59,57.95 47.08,58.46 47.08,62.9 A.6
A-7: length 9.2
  Bottom Layer w0.254: 74LS283_2.14 48.09,62.59 45.05,65.64 45.05,67.48 44.83,67.69
A-8: length 10.3
  Bottom Layer w0.254: 74LS283_2.12 53.17,61.89 47.37,67.69
ALU_OUT: length 23.2
  Top Layer w0.254: 74LS245.19 14.76,32.51 12.7,32.51 v1(12.19,32)
  Bottom Layer w0.254: 1)ALU_Out
2)ALU_Sub.1 12.19,23.62 v1(12.19,32)
ALU_SUBTRACT: length 107.1
  Top Layer w0.254: v1(53.48,28.88) 74LS86_2.5 51.45,21.77 v1(51.45,20.95) ; v1(45.86,28.62) 74LS86_2.2 46.37,23.29 v1(46.37,21.72)
  Bottom Layer w0.254: 74LS86_1.5 53.48,13.08 49.67,16.89 49.67,20.45 50.18,20.95 ; v1(53.48,28.88) 74LS86_2.10 58.25,36.19 74LS283_1.7 ; 43.69,16 44.47,16 74LS86_1.13 45.86,21.21 v1(46.37,21.72) 47.13,20.95 50.18,20.95 ; 43.69,16 43.69,11.96 74LS86_1.2 ; 43.69,16 42.93,16 39.88,12.95 5.59,12.95 1)ALU_Out
2)ALU_Sub.2 ; 50.18,20.95 v1(51.45,20.95) 51.45,19.43 74LS86_1.10 ; v1(45.86,28.62) 74LS86_2.13
B-1: length 24.6
  Top Layer w0.254: 74LS86_1.12 35.7,4.7 30.86,4.7 B.1
B-2: length 33.3
  Top Layer w0.254: B.2 33.4,2.16 45.1,2.16 45.86,2.92 45.86,4.44 49.67,8.25 49.67,10.29 56.02,16.64 74LS86_1.9
B-3: length 20.3
  Bottom Layer w0.254: B.3 35.94,2.16 37.48,2.16 38.24,2.92 38.24,3.43 39.51,4.7 45.86,4.7 74LS86_1.4
B-4: length 8.9
  Bottom Layer w0.254: 37.21,3.43 43.32,9.54 74LS86_1.1
B-5: length 32.6
  Top Layer w0.254: B.5 44.59,8.27 44.59,11.86 49.67,16.94 49.67,30.15 74LS86_2.12
B-6: length 42.1
  Top Layer w0.254: v1(56.53,13.64) 60.34,17.45 60.34,27.1 74LS86_2.9
  Bottom Layer w0.254: B.6 43.51,2.21 47.64,2.21 54.75,9.32 54.75,11.86 v1(56.53,13.64)
B-7: length 24.2
  Top Layer w0.254: 74LS86_2.4 50.69,23.54 50.69,20.5 52.21,18.97 52.21,16.94 47.13,11.86 47.13,9.32 44.83,7.02 44.83,3.43
B-8: length 26
  Top Layer w0.254: v1(47.12,16.96) 47.12,20.01 74LS86_2.1
  Bottom Layer w0.254: v1(47.12,16.96) 52.2,11.88 52.2,8.25 47.37,3.43
BUS_1: length 44.6
  Top Layer w0.254: v1(6.73,49.25) 8,49.25 18.16,39.09 18.16,38.84 17.65,38.33 v1(17.65,34.26) ; v1(29.84,30.12) 34.93,30.12 74LS245.11
  Bottom Layer w0.254: v1(17.65,34.26) 17.91,34.52 21.89,34.52 24.77,31.65 24.77,31.14 25.78,30.12 v1(29.84,30.12) ; v1(6.73,49.25) BUS.1
BUS_2: length 36.7
  Top Layer w0.254: v1(17.4,39.01) 7.82,48.59 BUS.2 ; v1(29.34,34.44) 30.61,34.44 74LS245.12
  Bottom Layer w0.254: v1(29.34,34.44) 25.78,34.44 23.75,36.47 18.67,36.47 17.65,37.49 17.65,38.76 v1(17.4,39.01)
BUS_3: length 33.1
  Top Layer w0.254: v1(15.88,36.47) 13.16,36.47 6.05,43.58 6.05,44.85 BUS.3
  Bottom Layer w0.254: 74LS245.13 28.58,33.93 25.53,33.93 23.5,35.96 18.42,35.96 17.91,36.47 v1(15.88,36.47)
BUS_4: length 28.7
  Top Layer w0.254: v1(16.38,35.71) 12.65,35.71 BUS.4
  Bottom Layer w0.254: 74LS245.14 26.54,33.42 25.27,33.42 23.24,35.46 16.64,35.46 v1(16.38,35.71)
BUS_5: length 25.2
  Top Layer w0.254: BUS.5 10.87,34.95 v1(15.88,34.95)
  Bottom Layer w0.254: 74LS245.15 22.48,34.95 v1(15.88,34.95)
BUS_6: length 21.6
  Top Layer w0.254: v1(15.88,33.93) 9.35,33.93 BUS.6
  Bottom Layer w0.254: v1(15.88,33.93) 17.15,33.93 17.4,33.68 21.21,33.68 74LS245.16
BUS_7: length 18
  Top Layer w0.254: v1(16.13,33.17) 7.57,33.17 BUS.7
  Bottom Layer w0.254: v1(16.13,33.17) 19.18,33.17 74LS245.17
BUS_8: length 15.4
  Top Layer w0.254: BUS.8 8.08,30.12 17.15,30.12 74LS245.18
CARRY_BIT: length 88.2
  Top Layer w0.254: 74LS283_2.9 59.48,61.11 44.7,61.11 44.45,60.86 43.94,60.86 42.93,61.87 v1(42.93,62.38) ; v1(32.26,62.38) 19.3,62.38 17.78,60.86 17.78,59.84 7.87,49.94 4.57,49.94 3.81,49.17 3.81,27.08 1)Carry_Bit
2)Zero_Bit.1
  Bottom Layer w0.254: v1(32.26,62.38) v1(42.93,62.38)
ZERO_BIT: length 46.2
  Top Layer w0.254: 1)Carry_Bit
2)Zero_Bit.2 5.84,22.5 26.42,22.5 27.18,23.27 27.18,35.2 27.94,35.97 27.94,38.51 29.13,39.7 74LS08.8
$1N3474: length 4
  Bottom Layer w0.254: LED1.1 80.15,60.89 R1.2
$1N3475: length 113.9
  Top Layer w0.254: 61.81,60.56 62.83,59.54 85.28,59.54 LED1.2 ; 61.81,60.56 60.79,61.58 v1(44.26,61.58) ; 61.81,60.56 61.81,59.04 61.3,58.53 59.52,58.53 74LS283_2.10 ; 74LS02.2 20.13,56.39 20.13,60.81 20.89,61.58 v1(22.67,61.58)
  Bottom Layer w0.254: 74LS02.2 15.11,51.37 15.11,32.58 14.61,32.07 14.61,25.04 74LS245.2 ; v1(22.67,61.58) v1(44.26,61.58)
$1N3476: length 4
  Bottom Layer w0.254: R2.2 80.15,53.26 LED2.1
$1N3477: length 4
  Bottom Layer w0.254: R3.2 80.15,45.63 LED3.1
$1N3478: length 98.5
  Top Layer w0.254: 26.48,51.05 26.22,51.31 25.21,51.31 74LS02.5 ; 26.48,51.05 33.08,51.05 v1(33.89,51.86) ; 26.48,51.05 22.67,47.24 22.67,37.34 22.16,36.83 22.16,24.98 74LS245.4 ; LED3.2 81.67,50.59 53.43,50.59 v1(52.16,49.32) ; v1(43.27,50.59) 45.81,48.05 v1(49.11,48.05)
  Bottom Layer w0.254: v1(33.89,51.86) 74LS283_2.1 43.01,50.84 v1(43.27,50.59) ; v1(49.11,48.05) 50.89,48.05 v1(52.16,49.32)
$1N3479: length 4
  Bottom Layer w0.254: LED4.1 80.15,38.01 R4.2
$1N3480: length 4
  Bottom Layer w0.254: LED5.1 80.15,30.38 R5.2
$1N3481: length 4
  Bottom Layer w0.254: R6.2 80.15,22.76 LED6.1
$1N3482: length 4
  Bottom Layer w0.254: R7.2 80.15,15.13 LED7.1
$1N3483: length 106.8
  Top Layer w0.254: v1(34.12,27.05) 34.12,26.78 74LS245.8 ; LED7.2 85.34,16.41 80.58,16.41 72.96,24.03 69.91,24.03 v1(57.47,36.47) ; v1(48.32,35.46) 48.58,35.46 v1(50.61,33.43) ; v1(26.73,54.86) v1(28.51,54.86)
  Bottom Layer w0.254: v1(34.12,27.05) 43.01,35.94 74LS283_1.1 ; v1(57.47,36.47) 54.42,33.43 v1(50.61,33.43) ; 74LS283_1.1 42.99,37.74 42.99,40.39 v1(28.51,54.86) ; 74LS283_1.1 45.28,35.46 v1(48.32,35.46) ; 74LS02.11 v1(26.73,54.86)
$1N3484: length 4
  Bottom Layer w0.254: R8.2 80.15,7.51 LED8.1
$1N3486: length 15.7
  Bottom Layer w0.254: 74LS08.1 12.62,39.2 12.62,46.12 13.78,47.27 13.78,52.58
$1N3487: length 9.7
  Bottom Layer w0.254: 74LS08.10 18.97,40.47 74LS08.3
$1N3488: length 24.2
  Top Layer w0.254: 74LS08.4 20.38,39.05 20.38,46.23 22.67,48.51 22.67,58.93 74LS02.10
$1N3489: length 16.7
  Bottom Layer w0.254: 74LS08.2 16.43,43.8 17.59,44.96 17.59,48.77 74LS02.4
$1N3491: length 106.7
  Top Layer w0.254: v1(49.09,47.24) 48.83,47.5 41.72,47.5 37.91,51.31 ; 74LS02.8 37.91,51.31 ; 37.91,51.31 33.59,46.99 28.77,46.99 27.75,45.97 27.75,40.89 25.53,38.67 25.53,32.58 24.77,31.81 24.77,25.04 74LS245.6 ; LED5.2 85.31,31.69 72.22,31.69 74LS283_1.10 56.16,47.75 v1(52.64,47.75)
  Bottom Layer w0.254: v1(52.64,47.75) 52.13,47.24 v1(49.09,47.24)
$1N3492: length 101.7
  Top Layer w0.254: v1(32.58,52.32) 30.8,54.1 28,54.1 74LS02.6 ; v1(43.24,54.1) 44,53.34 v1(48.32,53.34) ; v1(28,28.28) 28,29.21 29.78,30.99 29.78,31.75 28,33.53 v1(28,35.05) ; v1(53.68,49.83) 74,49.83 84.67,39.16 85.47,39.16 LED4.2
  Bottom Layer w0.254: v1(43.24,54.1) 34.35,54.1 v1(32.58,52.32) ; v1(28,28.28) 74LS245.5 ; 74LS02.6 26.48,47.5 28,45.97 v1(28,35.05) ; v1(48.32,53.34) 49.15,53.34 74LS283_2.4 52.67,49.83 v1(53.68,49.83)
$1N3493: length 110.8
  Top Layer w0.254: v1(41.57,59.8) 41.57,59.54 42.59,58.53 49.36,58.53 74LS283_2.13 57.17,53.26 68.09,53.26 69.36,51.99 85.35,51.99 LED2.2 ; v1(35.73,59.8) 33.95,61.58 23.54,61.58 22.78,60.81 22.78,59.8 22.16,59.18 22.16,55.88 17.91,51.63 17.91,40.7 20.45,38.16 20.45,32.58 19.69,31.81 19.69,25.04 74LS245.3
  Bottom Layer w0.254: v1(35.73,59.8) v1(41.57,59.8)
$1N3494: length 7.3
  Bottom Layer w0.254: 74LS283_1.9 60.79,49.32 74LS283_2.7
$1N3495: length 118.3
  Top Layer w0.254: v1(32.58,47.75) 30.03,50.29 v1(28.77,50.29) ; v1(47.81,32.89) 44.26,36.45 42.48,36.45 41.72,37.21 v1(41.72,37.46)
  Bottom Layer w0.254: LED8.2 85.36,8.76 84.6,8.76 78.76,14.6 78.76,18.41 70.12,27.05 69.62,27.05 59.71,36.96 59.71,37.97 58.69,38.99 51.9,38.99 74LS283_1.4 50.63,35.71 v1(47.81,32.89) ; v1(28.77,50.29) 27.75,51.31 27.75,53.09 26.73,54.1 24.96,54.1 18.86,60.2 ; 74LS245.9 33.4,24.03 33.4,28.38 34.86,29.84 34.86,31.62 40.7,37.46 v1(41.72,37.46) 41.72,38.35 32.58,47.5 v1(32.58,47.75)
$1N3496: length 106.6
  Top Layer w0.254: 74LS02.9 v1(36.13,50.55) ; 74LS245.7 32.49,27.69 34.1,27.69 37.4,30.99 37.4,42.93 v1(41.21,46.74) 41.47,46.99 46.04,46.99 47.05,45.97 47.05,44.96 47.56,44.45 49.43,44.45 74LS283_1.13 57.24,39.05 63.08,39.05 78.07,24.07 85.31,24.07 LED6.2
  Bottom Layer w0.254: v1(36.13,50.55) 39.94,46.74 v1(41.21,46.74)
$1N3497: length 41
  Bottom Layer w0.254: 74LS283_2.11 56.79,58.73 56.79,51.23 54.5,48.94 54.5,44.12 49.42,39.04 49.42,35.48 47.13,33.2 47.13,25.07 74LS86_2.3
$1N3498: length 26.8
  Top Layer w0.254: 74LS283_2.2 45.61,51.8 46.37,51.8 51.71,46.47 51.71,45.45 54.31,42.85 v1(54.5,42.85) ; v1(53.99,39.8) 54.25,39.55 54.25,35.74 74LS86_2.8
  Bottom Layer w0.254: v1(54.5,42.85) 53.99,42.34 v1(53.99,39.8)
$1N3499: length 23.9
  Top Layer w0.254: 74LS86_2.11 51.2,31.67 51.2,35.48 49.42,37.26 v1(49.42,41.32)
  Bottom Layer w0.254: 74LS283_2.6 55.71,50.84 53.23,48.36 53.23,47.42 51.96,46.15 51.96,43.86 v1(49.42,41.32)
$1N3502: length 40.4
  Top Layer w0.254: v1(55.52,39.75) 56.79,38.48 56.79,34.67 v1(57.29,34.16) ; v1(55.26,26.03) 54.75,25.53 54.75,16.13 74LS86_1.3
  Bottom Layer w0.254: v1(55.26,26.03) 57.29,28.07 v1(57.29,34.16) ; v1(55.52,39.75) 55.52,45.46 74LS283_1.11
$1N3503: length 43.1
  Top Layer w0.254: 74LS283_1.15 46.63,44.59 46.63,34.92 49.67,31.88 49.67,30.86 50.44,30.1 53.23,30.1 57.29,26.03 57.29,16.89 55.77,15.37 55.77,10.03 74LS86_1.6
$1N3504: length 33.9
  Top Layer w0.254: v1(54.5,34.42) 54.75,34.16 54.75,30.86 59.83,25.78 59.83,20.19 v1(59.33,19.68)
  Bottom Layer w0.254: 74LS86_1.11 52.47,15.88 58.82,15.88 59.83,16.89 59.83,19.18 v1(59.33,19.68) ; v1(54.5,34.42) 54.5,36.5 74LS283_1.6
$1N3511: length 36.4
  Top Layer w0.254: v1(48.91,21.72) 48.66,21.72 47.13,23.24 47.13,28.32 44.59,30.86 44.59,33.66 41.04,37.21 41.04,37.72 42.31,38.99 44.28,38.99 74LS283_1.2
  Bottom Layer w0.254: v1(48.91,21.72) 54.25,21.72 74LS86_1.8
$1N3518: length 41.2
  Top Layer w0.254: v1(49.42,33.45) 47.39,35.48 v1(47.39,36.5)
  Bottom Layer w0.254: 74LS86_2.6 49.67,30.15 49.67,33.2 v1(49.42,33.45) ; v1(47.39,36.5) 46.63,37.26 46.63,38.28 44.54,40.36 44.54,58.78 74LS283_2.15
$1N3523: length 7.6
  Bottom Layer w0.254: 74LS08.6 74LS08.9
$1N3524: length 26.4
  Bottom Layer w0.254: 74LS02.13 22.67,53.85 22.67,48.77 25.21,46.23 25.21,39.08 74LS08.5
